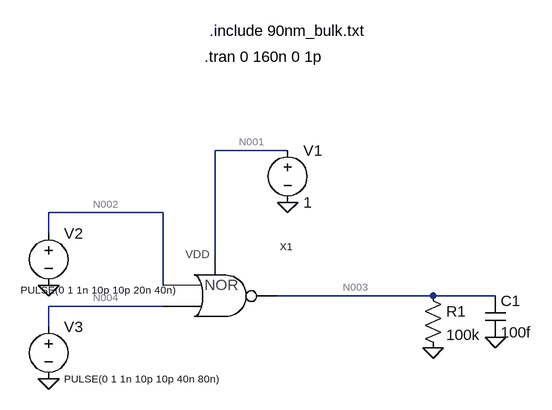
[diagram p0: schematic test.asc]
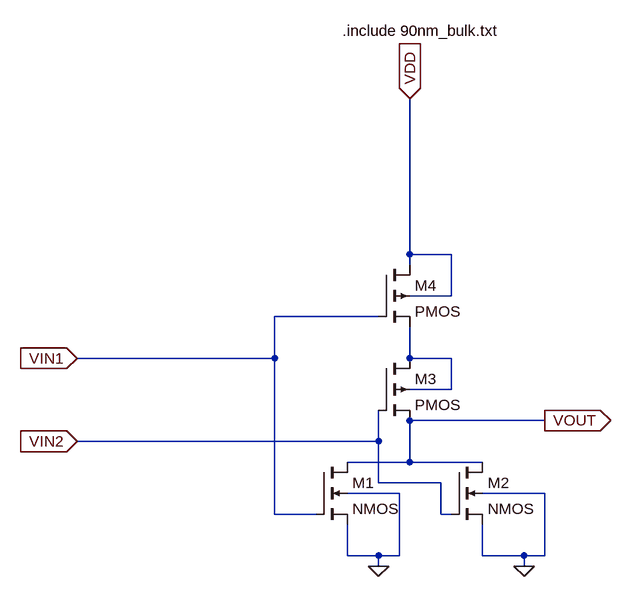
[diagram p1: sub-circuit nor.asc]
test.asc, the LTspice schematic file:
Version 4
SHEET 1 880 680
WIRE 352 -48 240 -48
WIRE 160 48 -16 48
WIRE -16 80 -16 48
WIRE 240 112 240 -48
WIRE 160 160 160 48
WIRE 576 176 336 176
WIRE 672 176 576 176
WIRE 160 192 -16 192
WIRE -16 224 -16 192
FLAG -16 160 0
FLAG -16 304 0
FLAG 352 32 0
FLAG 576 256 0
FLAG 672 240 0
SYMBOL NOR 240 176 R0
SYMATTR InstName X1
SYMBOL voltage 352 -64 R0
WINDOW 123 0 0 Left 0
WINDOW 39 0 0 Left 0
SYMATTR InstName V1
SYMATTR Value 1
SYMBOL voltage -16 64 R0
WINDOW 123 0 0 Left 0
WINDOW 39 0 0 Left 0
WINDOW 3 -43 103 Left 1
SYMATTR InstName V2
SYMATTR Value PULSE(0 1 1n 10p 10p 20n 40n)
SYMBOL voltage -16 208 R0
WINDOW 123 0 0 Left 0
WINDOW 39 0 0 Left 0
WINDOW 3 24 96 Left 1
SYMATTR InstName V3
SYMATTR Value PULSE(0 1 1n 10p 10p 40n 80n)
SYMBOL res 560 160 R0
SYMATTR InstName R1
SYMATTR Value 100k
SYMBOL cap 656 176 R0
SYMATTR InstName C1
SYMATTR Value 100f
TEXT 224 -192 Left 2 !.tran 0 160n 0 1p
TEXT 232 -232 Left 2 !.include 90nm_bulk.txt

nor.asc, the sub-circuit schematic file:
Version 4
SHEET 1 880 680
WIRE 336 -32 336 -272
WIRE 400 -32 336 -32
WIRE 336 -16 336 -32
WIRE 400 32 400 -32
WIRE 400 32 336 32
WIRE 288 64 128 64
WIRE 128 128 128 64
WIRE 128 128 -176 128
WIRE 336 128 336 80
WIRE 400 128 336 128
WIRE 400 176 400 128
WIRE 400 176 336 176
WIRE 336 224 336 208
WIRE 544 224 336 224
WIRE 288 256 288 208
WIRE 288 256 -176 256
WIRE 336 288 336 224
WIRE 336 288 240 288
WIRE 448 288 336 288
WIRE 288 320 288 256
WIRE 384 320 288 320
WIRE 320 336 240 336
WIRE 544 336 448 336
WIRE 128 368 128 128
WIRE 192 368 128 368
WIRE 384 368 384 320
WIRE 400 368 384 368
WIRE 240 432 240 384
WIRE 288 432 240 432
WIRE 320 432 320 336
WIRE 320 432 288 432
WIRE 448 432 448 384
WIRE 512 432 448 432
WIRE 544 432 544 336
WIRE 544 432 512 432
WIRE 288 448 288 432
WIRE 512 448 512 432
FLAG 288 448 0
FLAG 512 448 0
FLAG 544 224 VOUT
IOPIN 544 224 Out
FLAG -176 128 VIN1
IOPIN -176 128 In
FLAG -176 256 VIN2
IOPIN -176 256 In
FLAG 336 -272 VDD
IOPIN 336 -272 In
SYMBOL nmos4 192 288 R0
SYMATTR InstName M1
SYMATTR Value2 l=90n w=200n
SYMBOL nmos4 400 288 R0
SYMATTR InstName M2
SYMATTR Value2 l=90n w=200n
SYMBOL pmos4 288 128 R0
SYMATTR InstName M3
SYMATTR Value2 l=90n w=400n
SYMBOL pmos4 288 -16 R0
SYMATTR InstName M4
SYMATTR Value2 l=90n w=400n
TEXT 232 -376 Left 2 !.include 90nm_bulk.txt

The netlist it stands for:
* test.asc
XX1 N002 N004 N001 N003 nor
V1 N001 0 1
V2 N002 0 PULSE(0 1 1n 10p 10p 20n 40n)
V3 N004 0 PULSE(0 1 1n 10p 10p 40n 80n)
R1 N003 0 100k
C1 N003 0 100f

* block symbol definitions
.subckt nor VIN1 VIN2 VDD VOUT
M1 VOUT VIN1 0 0 NMOS l=90n w=200n
M2 VOUT VIN2 0 0 NMOS l=90n w=200n
M3 N001 VIN2 VOUT N001 PMOS l=90n w=400n
M4 VDD VIN1 N001 VDD PMOS l=90n w=400n
.include 90nm_bulk.txt
.ends nor

.model NMOS NMOS
.model PMOS PMOS
.lib standard.mos
.tran 0 160n 0 1p
.include 90nm_bulk.txt
.backanno
.end

* Results of the author's LTspice run, read from the files saved beside the schematic
* Operating Point, zero values left out:
*   V(n003) = 945.9 mV
*   V(n001) = 1 V
*   I(R1) = 9.459 µA
*   I(V3) = 93.3 pA
*   I(V2) = 93.66 pA
*   I(V1) = -9.468 µA
*   Ix(x1:VIN1) = -93.66 pA
*   Ix(x1:VIN2) = -93.3 pA
*   Ix(x1:VDD) = 9.468 µA
*   Ix(x1:VOUT) = -9.459 µA
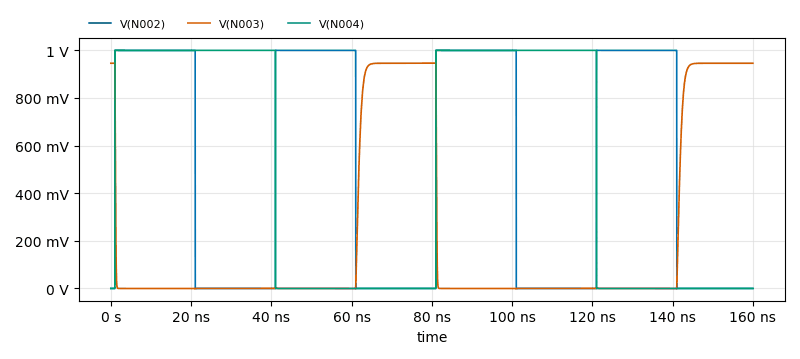
[diagram p2: Transient Analysis of test.asc, plotted from the saved traces]
* Transient Analysis, 1 run:
*   V(N002): min 0 V, max 1 V, average 500.2 mV, rms 707.2 mV, last 0 V
*   V(N003): min -1.533 mV, max 948.4 mV, average 227.8 mV, rms 458.7 mV, last 945.9 mV
*   V(N004): min 0 V, max 1 V, average 500.1 mV, rms 707.2 mV, last 0 V